# Altium schematic sheet SkyPulseUAV_ESC.SchDoc: Electronic Speed Control
size A4; Date: Feb. 04, 2024; Author: Binhan Tian; Revision: V0.1; SheetNumber: 4; SheetTotal: 4
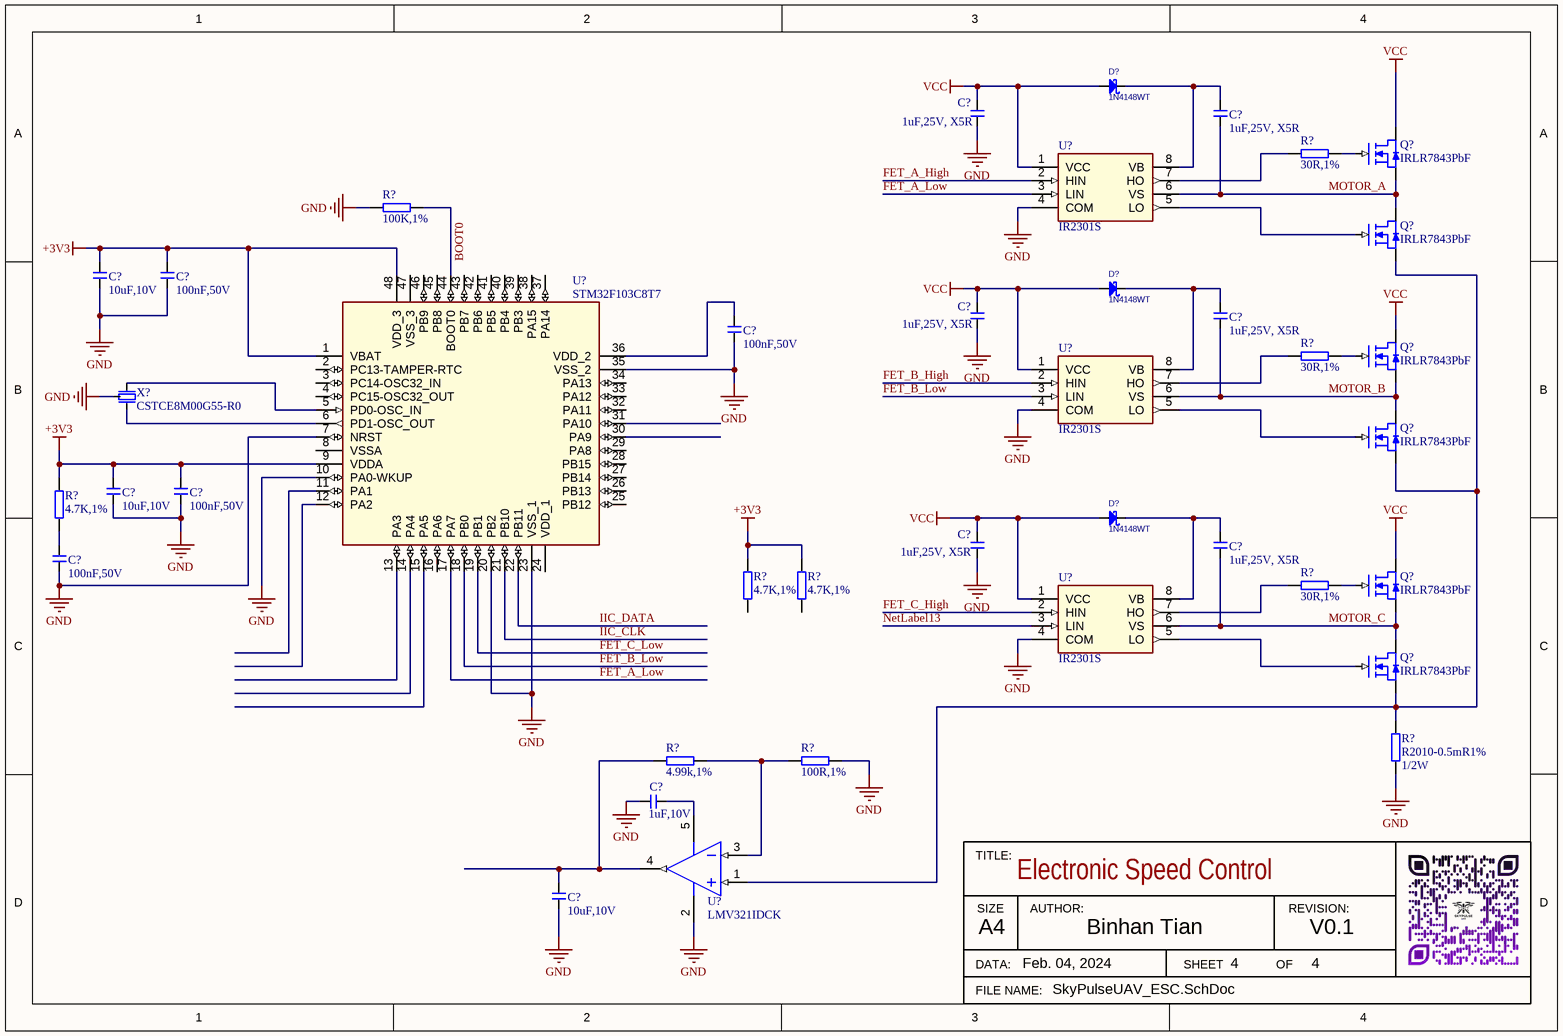
[diagram p0: SkyPulseUAV_ESC.SchDoc]

## Parts
(Parts that share a designator on the sheet are numbered #1, #2 ... from top to bottom, then left to right.)
C?#1  value 1uF,25V, X5R  [CAPC2012L]  (hidden comment: C0805-1uF/25V)
C?#2  value 1uF,25V, X5R  [CAPC2012L]  (hidden comment: C0805-1uF/25V)
C?#3  value 10uF,10V  [CAPC1608L]  (hidden comment: C0603-10uF/10V)
C?#4  value 100nF,50V  [CAPC1608L]  (hidden comment: C0603-100nF/50V)
C?#5  value 1uF,25V, X5R  [CAPC2012L]  (hidden comment: C0805-1uF/25V)
C?#6  value 1uF,25V, X5R  [CAPC2012L]  (hidden comment: C0805-1uF/25V)
C?#7  value 100nF,50V  [CAPC1608L]  (hidden comment: C0603-100nF/50V)
C?#8  value 10uF,10V  [CAPC1608L]  (hidden comment: C0603-10uF/10V)
C?#9  value 100nF,50V  [CAPC1608L]  (hidden comment: C0603-100nF/50V)
C?#10  value 1uF,25V, X5R  [CAPC2012L]  (hidden comment: C0805-1uF/25V)
C?#11  value 1uF,25V, X5R  [CAPC2012L]  (hidden comment: C0805-1uF/25V)
C?#12  value 100nF,50V  [CAPC1608L]  (hidden comment: C0603-100nF/50V)
C?#13  value 1uF,10V  [CAPC1608L]  (hidden comment: C0603-1uF/10V)
C?#14  value 10uF,10V  [CAPC1608L]  (hidden comment: C0603-10uF/10V)
D?#1  1N4148WT  [DIOM1608X06N]
D?#2  1N4148WT  [DIOM1608X06N]
D?#3  1N4148WT  [DIOM1608X06N]
Q?#1  IRLR7843PbF  [TO230P990X239-3N]
Q?#2  IRLR7843PbF  [TO230P990X239-3N]
Q?#3  IRLR7843PbF  [TO230P990X239-3N]
Q?#4  IRLR7843PbF  [TO230P990X239-3N]
Q?#5  IRLR7843PbF  [TO230P990X239-3N]
Q?#6  IRLR7843PbF  [TO230P990X239-3N]
R?#1  value 30R,1%  [RESC1608L]  (hidden comment: R0603-30R)
R?#2  value 100K,1%  [RESC1608L]  (hidden comment: R0603-100K)
R?#3  value 30R,1%  [RESC1608L]  (hidden comment: R0603-30R)
R?#4  value 4.7K,1%  [RESC1608L]  (hidden comment: R0603-4.7K)
R?#5  value 30R,1%  [RESC1608L]  (hidden comment: R0603-30R)
R?#6  value 4.7K,1%  [RESC1608L]  (hidden comment: R0603-4.7K)
R?#7  value 4.7K,1%  [RESC1608L]  (hidden comment: R0603-4.7K)
R?#8  value 4.99k,1%  [RESC1608L]  (hidden comment: R0603-4.99k)
R?#9  value 100R,1%  [RESC1608L]  (hidden comment: R0603-100R)
R?#10  R2010-0.5mR1%  功?: 1/2W  [RC2010-5025X07N]
U?#1  IR2301S
U?#2  STM32F103C8T7  [TSQFP50P900X900X160-48L]
U?#3  IR2301S
U?#4  IR2301S
U?#5  LMV321IDCK  [SOT65P210X110-5L(SC70)]
X?  CSTCE8M00G55-R0  [CSTCE_G]

## Nets
+3V3: C?#3.1 C?#4.1 C?#8.1 C?#9.1 R?#4.2 R?#6.2 R?#7.2 U?#2.1(VBAT) U?#2.9(VDDA) U?#2.48(VDD_3)
GND: C?#1.2 C?#3.2 C?#4.2 C?#5.2 C?#7.2 C?#8.2 C?#9.2 C?#10.2 C?#12.2 C?#13.2 C?#14.2 R?#2.1 R?#9.2 R?#10.1 U?#1.4(COM) U?#2.7(NRST) U?#2.10(PA0-WKUP) U?#2.20(PB2) U?#2.23(VSS_1) U?#2.35(VSS_2) U?#3.4(COM) U?#4.4(COM) U?#5.2(GND) X?.2(GND)
VCC: C?#1.1 C?#5.1 C?#10.1 D?#1.1(A) D?#2.1(A) D?#3.1(A) Q?#1.4(D) Q?#3.4(D) Q?#5.4(D) U?#1.1(VCC) U?#3.1(VCC) U?#4.1(VCC)
BOOT0: R?#2.2 U?#2.44(BOOT0)
FET_A_High: U?#1.2(HIN)
FET_A_Low: U?#1.3(LIN) U?#2.17(PA7)
FET_B_High: U?#3.2(HIN)
FET_B_Low: U?#2.18(PB0) U?#3.3(LIN)
FET_C_High: U?#4.2(HIN)
FET_C_Low: U?#2.19(PB1)
IIC_CLK: U?#2.21(PB10)
IIC_DATA: U?#2.22(PB11)
MOTOR_A: C?#2.2 Q?#1.3(S) Q?#2.4(D) U?#1.6(VS)
MOTOR_B: C?#6.2 Q?#3.3(S) Q?#4.4(D) U?#3.6(VS)
MOTOR_C: C?#11.2 Q?#5.3(S) Q?#6.4(D) U?#4.6(VS)
NetLabel13: U?#4.3(LIN)
NetC?#2_1: C?#2.1 D?#1.2(K) U?#1.8(VB)
NetC?#6_1: C?#6.1 D?#2.2(K) U?#3.8(VB)
NetC?#7_1: C?#7.1 U?#2.36(VDD_2)
NetC?#11_1: C?#11.1 D?#3.2(K) U?#4.8(VB)
NetC?#12_1: C?#12.1 R?#4.1
NetC?#13_1: C?#13.1 U?#5.5(V+)
NetC?#14_1: C?#14.1 R?#8.1 U?#5.4(OUT1)
NetQ?#1_1: Q?#1.1(G) R?#1.2
NetQ?#2_1: Q?#2.1(G) U?#1.5(LO)
NetQ?#2_3: Q?#2.3(S) Q?#4.3(S) Q?#6.3(S) R?#10.2 U?#5.1(IN1+)
NetQ?#3_1: Q?#3.1(G) R?#3.2
NetQ?#4_1: Q?#4.1(G) U?#3.5(LO)
NetQ?#5_1: Q?#5.1(G) R?#5.2
NetQ?#6_1: Q?#6.1(G) U?#4.5(LO)
NetR?#1_1: R?#1.1 U?#1.7(HO)
NetR?#3_1: R?#3.1 U?#3.7(HO)
NetR?#5_1: R?#5.1 U?#4.7(HO)
NetR?#8_2: R?#8.2 R?#9.1 U?#5.3(IN1-)
NetU?#2_5: U?#2.5(PD0-OSC_IN) X?.1
NetU?#2_6: U?#2.6(PD1-OSC_OUT) X?.3

Not connected (* = marked no-connect by the designer): R?#6 1; R?#7 1; U?#2 2(PC13-TAMPER-RTC) 3(PC14-OSC32_IN) 4(PC15-OSC32_OUT) 8(VSSA) 11(PA1) 12(PA2) 13(PA3) 14(PA4) 15(PA5) 16(PA6) 24(VDD_1) 25(PB12) 26(PB13) 27(PB14) 28(PB15) 29(PA8) 30(PA9) 31(PA10) 32(PA11) 33(PA12) 34(PA13) 37(PA14) 38(PA15) 39(PB3) 40(PB4) 41(PB5) 42(PB6) 43(PB7) 45(PB8) 46(PB9) 47(VSS_3)

## Notes on the sheet
- TITLE:
- SIZE
- AUTHOR:
- REVISION:
- DATA:
- FILE NAME:
- A4
- SHEET
- OF

## Library data of the parts
C?#1 C?#2 C?#5 C?#6 C?#10 C?#11 = C0805-1uF/25V: X5R,20%; Mfr P/N: C2012X5R1E105K
C?#3 C?#8 = C0603-100nF/50V_2: X7R
C?#4 C?#7 C?#9 C?#12 = C0603-100nF/50V: X7R
C?#13 = C0603-1uF/10V: X5R,20%
C?#14 = C0603-10uF/10V: X5R,20%
D?#1-D?#3 = 1N4148WT: SURFACE MOUNT FAST SWITCHING DIODE; Mfr: DIODES; TOPMARK: T4
Q?#1-Q?#6 = IRLR7843PbF: Power MOSFET
R?#1 R?#3 R?#5 = R0603-22R: 22R,1%; Tolerance: 1%
R?#2 = R0603-100K: 100K,1%; Tolerance: 1%
R?#4 R?#6 R?#7 = R0603-4.7K: 4.7K,1%; Tolerance: 1%
R?#8 = R0603-49.9K: 4.99k,1%; Tolerance: 1%
R?#9 = R0603-100R: 100R,1%; Tolerance: 1%
R?#10 = Power Resistor: Vishay WSL Power type resistance; 器?: -; 制?: Vishay
U?#1 U?#3 U?#4 = IR2301S: High and Low Side Driver
U?#5 = LMV321IDCK: Low voltage rail to rail output operational amplifiers